# Altium schematic sheet nufsr-power-decoupling.schdoc: NUSense
size A4; Organization: Elby Designs; Address1: 9 Follan Close; Address2: Kariong; Address3: NSW 2250; Address4: Australia; Revision: 1; SheetNumber: 15; SheetTotal: 15; DrawnBy: Power Supply Decoupling; Engineer: Laurie Biddulph; PageSetup: Record=PageOptions|CenterHorizontal=True|CenterVertical=True|PrintScale=1.38|XCorrection=1.00|YCorrection=1.00|PrintKind=1|BorderSize=5000000|LeftOffset=0|BottomOffset=0|Orientation=2|PaperLength=1000|PaperWidth=1000|Scale=100|PaperSource=7|PrintQuality=-4|MediaType=1|DitherType=10|PaperKind=A3|PrintScaleMode=1
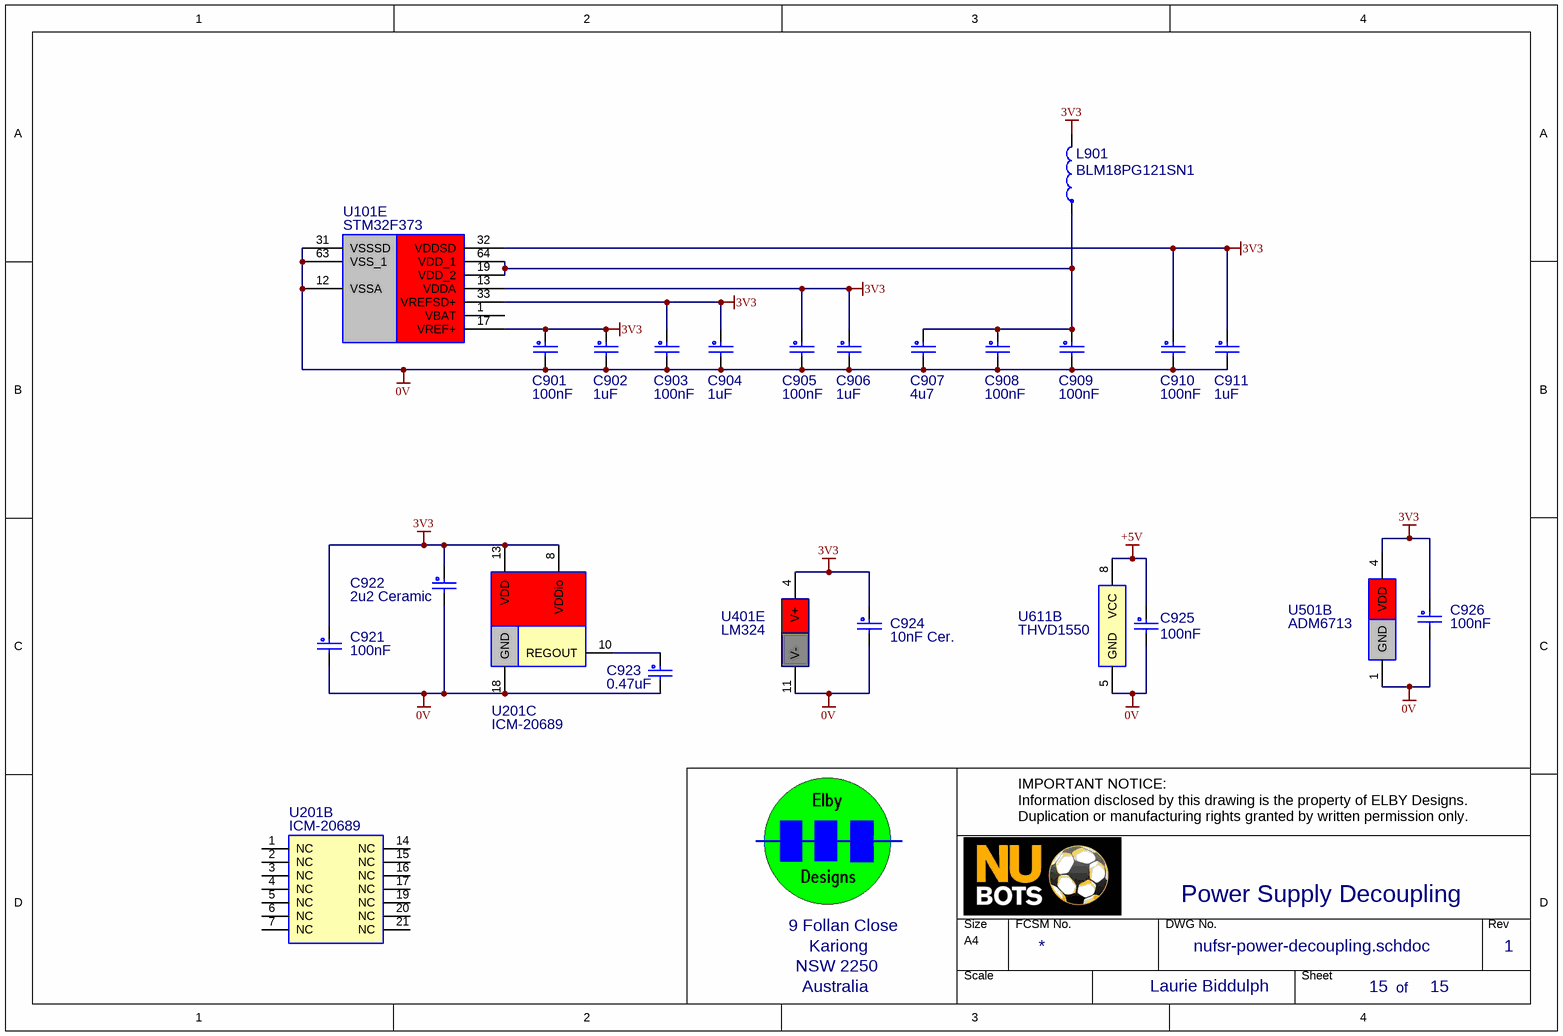
[diagram p0: nufsr-power-decoupling.schdoc]

## Parts
C901  100nF  [0603(LB)]
C902  1uF  [0805(LB)]
C903  100nF  [0603(LB)]
C904  1uF  [0805(LB)]
C905  100nF  [0603(LB)]
C906  1uF  [0805(LB)]
C907  4u7  [0805(LB)]
C908  100nF  [0603(LB)]
C909  100nF  [0603(LB)]
C910  100nF  [0603(LB)]
C911  1uF  [0805(LB)]
C921  100nF  [0603(LB)]
C922  2u2 Ceramic  [0805(LB)]
C923  0.47uF  [0805(LB)]
C924  10nF Cer.  [0603(LB)]
C925  100nF  [0603(LB)]
C926  100nF  [0603(LB)]
L901  value BLM18PG121SN1  [0603(LB)]  (hidden comment: Ferrite Bead)
U101  STM32F373  [LQFP-64_10x10(LB)]  (part E of 5)
U201  ICM-20689  [QFN-24]  (parts B,C of 3)
U401  LM324  [SO-14(LB)]  (part E of 5)
U501  ADM6713  [SC70-4]  (part B of 2)
U611  THVD1550  [SO-8(LB)]  (part B of 2)

## Nets
0V: C901.2 C902.2 C903.2 C904.2 C905.2 C906.2 C907.2 C908.2 C909.2 C910.2 C911.2 C921.2 C922.2 C923.2 C924.2 C925.2 C926.2 U101.12(VSSA) U101.31(VSSSD) U101.63(VSS_1) U201.18(GND) U401.11(V-) U501.1(GND) U611.5(GND)
3V3: C901.1 C902.1 C903.1 C904.1 C905.1 C906.1 C910.1 C911.1 C921.1 C922.1 C924.1 C926.1 L901.2 U101.13(VDDA) U101.17(VREF+) U101.32(VDDSD) U101.33(VREFSD+) U201.8(VDDio) U201.13(VDD) U401.4(V+) U501.4(VDD)
+5V: C925.1 U611.8(VCC)
NetC907_1: C907.1 C908.1 C909.1 L901.1 U101.19(VDD_2) U101.64(VDD_1)
NetC923_1: C923.1 U201.10(REGOUT)

Not connected (* = marked no-connect by the designer): U101 1(VBAT); U201 1(NC) 2(NC) 3(NC) 4(NC) 5(NC) 6(NC) 7(NC) 14(NC) 15(NC) 16(NC) 17(NC) 19(NC) 20(NC) 21(NC)

## Notes on the sheet
- IMPORTANT NOTICE:
  Information disclosed by this drawing is the property of ELBY Designs.
  Duplication or manufacturing rights granted by written permission only.
- of

## Library data of the parts
C901 C903 C905 C908-C910 C921 C925 C926 = CC-100NF(LB): Monolithic Ceramic; EMRP: CC-100NF
C902 C904 C906 C911 = CC-1000NF(LB): 1uF Ceramic; EMRP: CC-1000NF
C907 = CC-4700NF(LB): 4.7uF Ceramic; EMRP: CC-4700NF
C922 = CC-2200NF(LB): 2.2uF Ceramic; EMRP: CC-2200NF
C923 = CP-470NF(LB): 63V 10% Metallised Polyester; EMRP: CP-470NF
C924 = CC-10NF(LB): Monolithic Ceramic; EMRP: CC-10NF
L901 = FERRITE-BEAD(LB): EMRP: IN-BEAD
U101 = STM32F373: 32-bit Microcontroller; Manufacturer_Part_Number: stm32f74xzxt; Vendor: STMicroelectronics; C: Copyright (C) 2016 Accelerated Designs. All rights reserved; Copyright: Copyright (C) 2016 Accelerated Designs. All rights reserved; Value: Value; Type: Type; RefDes: RefDes
U201 = ICM-20869: Motion Tracking
U401 = LM324(LB): Quad Low-noise JFET Op-amp; EMRP: SI-3-LM324
U501 = ADM6713: Microprocessor Supervisory Circuit
U611 = THVD1550(LB): RS485 Transceiver 18kV 50mbps; EMRP: SI-1-MAX485